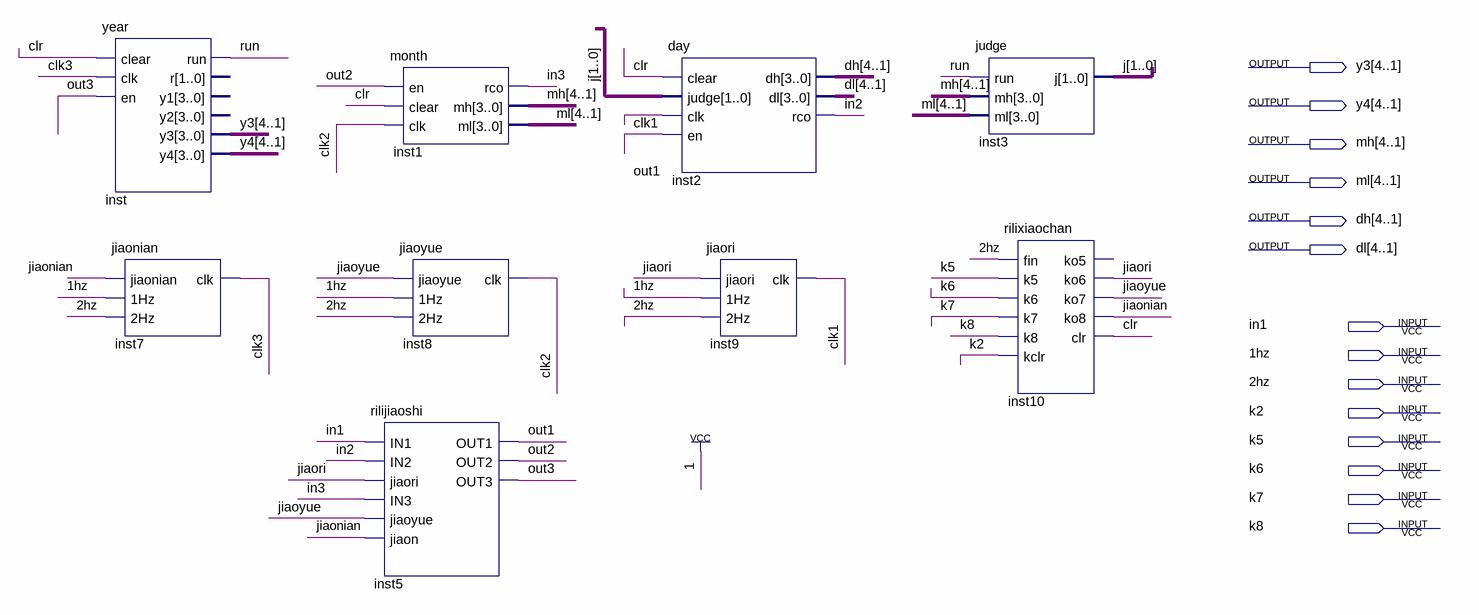
[diagram p0: schematic sheet]
// Quartus schematic nianli.bdf as structural Verilog: 9 symbols, 14 pins
module nianli (
  input  in1,
  input  \1hz ,
  input  \2hz ,
  input  k2,
  input  k5,
  input  k6,
  input  k7,
  input  k8,
  output [4:1] y3,
  output [4:1] y4,
  output [4:1] mh,
  output [4:1] ml,
  output [4:1] dh,
  output [4:1] dl
);

  wire clk1, clk2, clk3, clr, in2, in3, jiaonian, jiaori, jiaoyue, out1, out2, out3, run;
  wire [1:0] j;

  year inst (.clear(clr), .clk(clk3), .en(out3), .run(run), .y3(y3), .y4(y4));  // open: r, y1, y2
  jiaonian inst7 (.jiaonian(jiaonian), .\1Hz (\1hz ), .\2Hz (\2hz ), .clk(clk3));
  month inst1 (.en(out2), .clear(clr), .clk(clk2), .rco(in3), .mh(mh), .ml(ml));
  rilijiaoshi inst5 (
    .IN1(in1), .IN2(in2), .jiaori(jiaori), .IN3(in3), .jiaoyue(jiaoyue), .jiaon(jiaonian), .OUT1(out1),
    .OUT2(out2), .OUT3(out3));
  jiaoyue inst8 (.jiaoyue(jiaoyue), .\1Hz (\1hz ), .\2Hz (\2hz ), .clk(clk2));
  day inst2 (.clear(clr), .judge(j), .clk(clk1), .en(out1), .dh(dh), .dl(dl), .rco(in2));
  jiaori inst9 (.jiaori(jiaori), .\1Hz (\1hz ), .\2Hz (\2hz ), .clk(clk1));
  judge inst3 (.run(run), .mh(mh), .ml(ml), .j(j));
  rilixiaochan inst10 (
    .fin(\2hz ), .k5(k5), .k6(k6), .k7(k7), .k8(k8), .kclr(k2), .ko6(jiaori), .ko7(jiaoyue), .ko8(jiaonian),
    .clr(clr));  // open: ko5
endmodule
